# Altium schematic sheet Filter Capacitors - External SIM.SchDoc: External SIM Filter Capacitors
size A4; DocumentNumber: 35; SheetNumber: 35; SheetTotal: 54
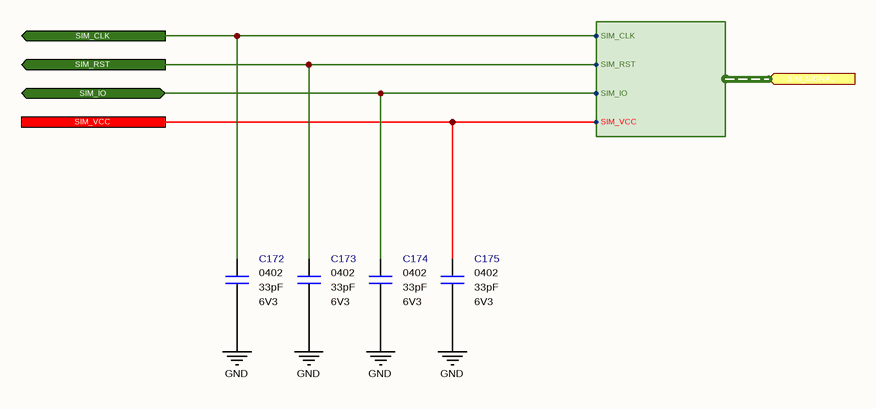
[diagram p0: Filter Capacitors - External SIM.SchDoc]

## Parts
C172  value 33pF  Case: 0402  Voltage: 6V3  [CAPACITOR_0402]  (hidden comment: Multilayer Ceramic Capacitor)
C173  value 33pF  Case: 0402  Voltage: 6V3  [CAPACITOR_0402]  (hidden comment: Multilayer Ceramic Capacitor)
C174  value 33pF  Case: 0402  Voltage: 6V3  [CAPACITOR_0402]  (hidden comment: Multilayer Ceramic Capacitor)
C175  value 33pF  Case: 0402  Voltage: 6V3  [CAPACITOR_0402]  (hidden comment: Multilayer Ceramic Capacitor)

## Ports
SIM_CLK (out), SIM_IO (bidir), SIM_RST (out), SIM_SIGNAL (in, harness SIM_SIGNAL), SIM_VCC

## Harnesses
SIM_SIGNAL: SIM_VCC, SIM_IO, SIM_RST, SIM_CLK

## Nets
GND: C172.1 C173.1 C174.1 C175.1
SIM_CLK: C172.2 ; port SIM_CLK, port SIM_SIGNAL.SIM_CLK
SIM_IO: C174.2 ; port SIM_IO, port SIM_SIGNAL.SIM_IO
SIM_RST: C173.2 ; port SIM_RST, port SIM_SIGNAL.SIM_RST
SIM_VCC: C175.2 ; port SIM_VCC, port SIM_SIGNAL.SIM_VCC

## Notes on the sheet
- Engineer
- All Rights are reserved to Customer and Engineer. [2021]
- Size:
- Date:
- A4
- Project :
- Time:
- Sheet
- of
- Customer
- Product ID
- Module ID
- Version
- File:
- Revision

## Library data of the parts
C172-C175 = Capacitor - 33pF [0402-6V3]: Capacitor - 33pF [0402] (Ceramic); Manufacturer Name: Kemet; Manufacturer Part Number: C0402C330J9RACAUTO; Dielectric: X7R; Tolerance: 10%; Height: 0.5mm; Maximum Operating Temperature: +125; Minimum Operating Temperature: -55; ROHS: Yes; ComponentLink1Description: DataSheet; ComponentLink1URL: https://api.kemet.com/component-edge/download/datasheet/C0402C330J9RACAUTO.pdf; ComponentLink2Description: Mouser; ComponentLink2URL: https://www.mouser.com/Search/Refine.aspx?Keyword=80-C0402C330J9RAUTO; Supplier 1: Mouser; Supplier Part Number 1: 80-C0402C330J9RAUTO; Mouser Part Number: 80-C0402C330J9RAUTO